# Altium project Logic adapter.PrjPcb
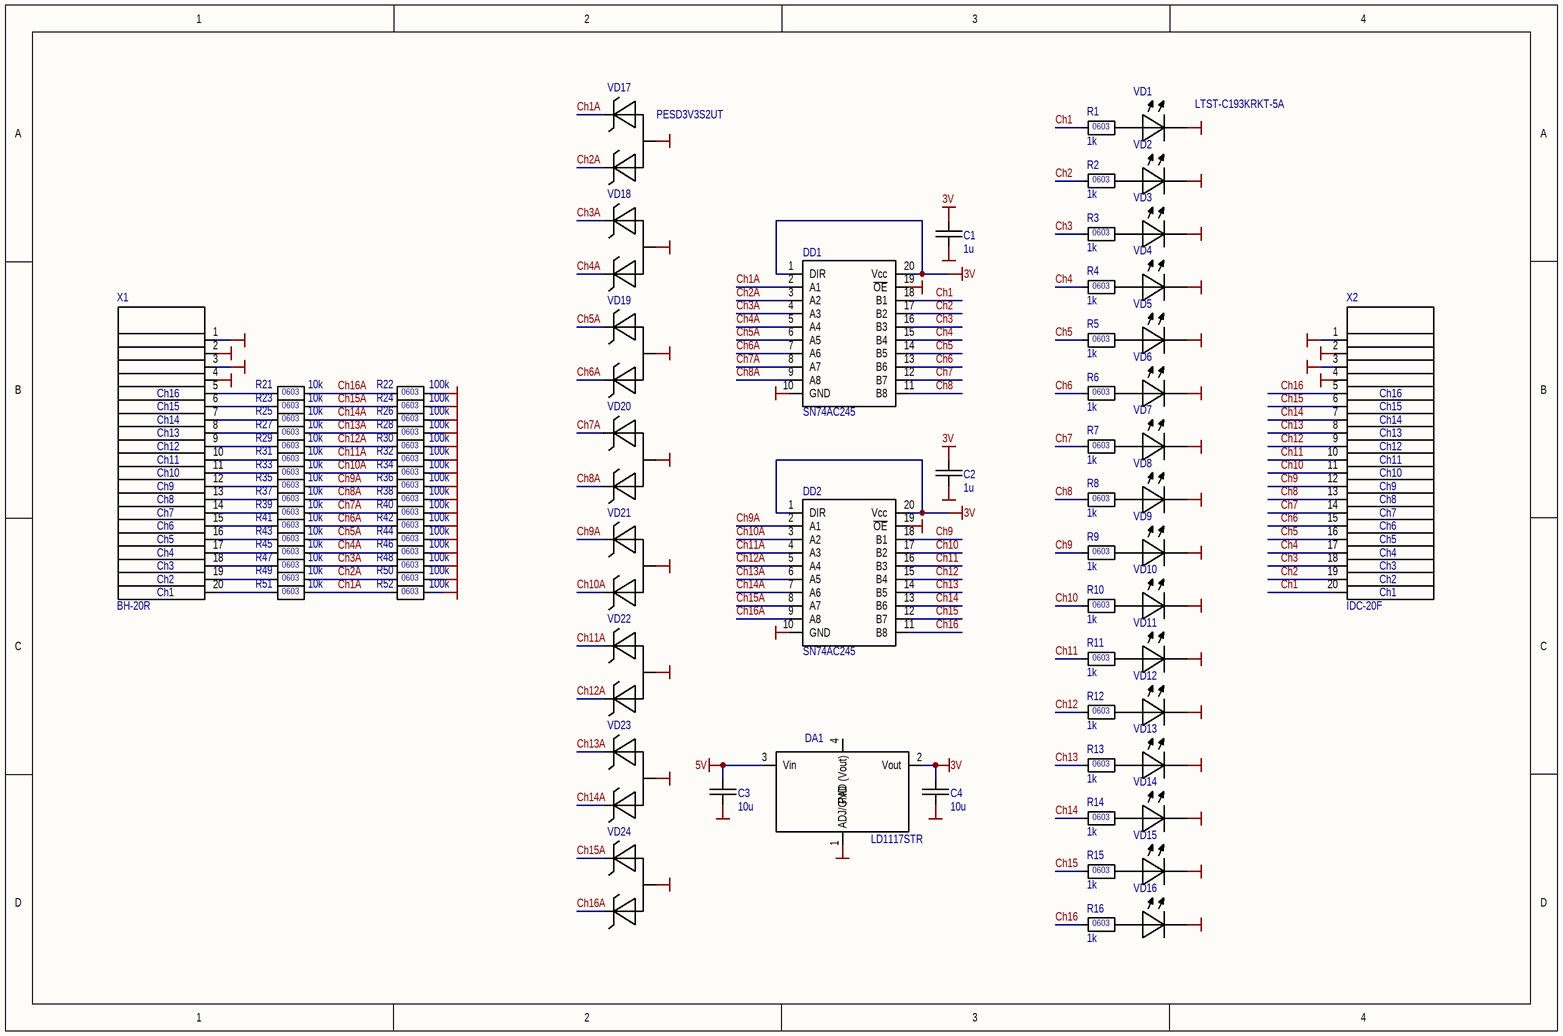
[diagram p0: Logic adapter.SchDoc]
Title: Logic adapter; Revision: Rev4
1 sheet, 81 parts. Net scope: global (net labels, ports and power ports of the same name join across sheets).
Board file: Logic adapter.PcbDoc

## Sheet Logic adapter.SchDoc: Logic adapter
size A4

### Parts
C1  1u  [C0603]
C2  1u  [C0603]
C3  10u  [C0805]
C4  10u  [C0805]
DA1  (no value)  [ON SEMI SOT-223 ST(318H)]
DD1  SN74AC245  [TI-SOIC20 DW]
DD2  SN74AC245  [TI-SOIC20 DW]
R1  1k  [R0603]
R2  1k  [R0603]
R3  1k  [R0603]
R4  1k  [R0603]
R5  1k  [R0603]
R6  1k  [R0603]
R7  1k  [R0603]
R8  1k  [R0603]
R9  1k  [R0603]
R10  1k  [R0603]
R11  1k  [R0603]
R12  1k  [R0603]
R13  1k  [R0603]
R14  1k  [R0603]
R15  1k  [R0603]
R16  1k  [R0603]
R21  10k  [R0603]
R22  100k  [R0603]
R23  10k  [R0603]
R24  100k  [R0603]
R25  10k  [R0603]
R26  100k  [R0603]
R27  10k  [R0603]
R28  100k  [R0603]
R29  10k  [R0603]
R30  100k  [R0603]
R31  10k  [R0603]
R32  100k  [R0603]
R33  10k  [R0603]
R34  100k  [R0603]
R35  10k  [R0603]
R36  100k  [R0603]
R37  10k  [R0603]
R38  100k  [R0603]
R39  10k  [R0603]
R40  100k  [R0603]
R41  10k  [R0603]
R42  100k  [R0603]
R43  10k  [R0603]
R44  100k  [R0603]
R45  10k  [R0603]
R46  100k  [R0603]
R47  10k  [R0603]
R48  100k  [R0603]
R49  10k  [R0603]
R50  100k  [R0603]
R51  10k  [R0603]
R52  100k  [R0603]
VD1  Part Number: LTST-C193KRKT-5A  [LTST-C193 RED]  (hidden comment: Red)
VD2  Red  [LTST-C193 RED]  (value not drawn)
VD3  Red  [LTST-C193 RED]  (value not drawn)
VD4  Red  [LTST-C193 RED]  (value not drawn)
VD5  Red  [LTST-C193 RED]  (value not drawn)
VD6  Red  [LTST-C193 RED]  (value not drawn)
VD7  Red  [LTST-C193 RED]  (value not drawn)
VD8  Red  [LTST-C193 RED]  (value not drawn)
VD9  Red  [LTST-C193 RED]  (value not drawn)
VD10  Red  [LTST-C193 RED]  (value not drawn)
VD11  Red  [LTST-C193 RED]  (value not drawn)
VD12  Red  [LTST-C193 RED]  (value not drawn)
VD13  Red  [LTST-C193 RED]  (value not drawn)
VD14  Red  [LTST-C193 RED]  (value not drawn)
VD15  Red  [LTST-C193 RED]  (value not drawn)
VD16  Red  [LTST-C193 RED]  (value not drawn)
VD17  PESD3V3S2UT  [NXP-SOT23]
VD18  PESD3V3S2UT  [NXP-SOT23]  (value not drawn)
VD19  PESD3V3S2UT  [NXP-SOT23]  (value not drawn)
VD20  PESD3V3S2UT  [NXP-SOT23]  (value not drawn)
VD21  PESD3V3S2UT  [NXP-SOT23]  (value not drawn)
VD22  PESD3V3S2UT  [NXP-SOT23]  (value not drawn)
VD23  PESD3V3S2UT  [NXP-SOT23]  (value not drawn)
VD24  PESD3V3S2UT  [NXP-SOT23]  (value not drawn)
X1  BH-20R  [BH-20R]
X2  IDC-20F  [IDC-20F-EDGE]

### Nets
3V: C1.1 C2.1 C4.1 DA1.2(Vout) DD1.1(DIR) DD1.20(Vcc) DD2.1(DIR) DD2.20(Vcc)
5V: C3.1 DA1.3(Vin)
GND: C1.2 C2.2 C3.2 C4.2 DA1.1(ADJ/GND) DD1.10(GND) DD1.19(~{OE}) DD2.10(GND) DD2.19(~{OE}) R22.2 R24.2 R26.2 R28.2 R30.2 R32.2 R34.2 R36.2 R38.2 R40.2 R42.2 R44.2 R46.2 R48.2 R50.2 R52.2 VD1.1(C) VD2.1(C) VD3.1(C) VD4.1(C) VD5.1(C) VD6.1(C) VD7.1(C) VD8.1(C) VD9.1(C) VD10.1(C) VD11.1(C) VD12.1(C) VD13.1(C) VD14.1(C) VD15.1(C) VD16.1(C) VD17.3(COM) VD18.3(COM) VD19.3(COM) VD20.3(COM) VD21.3(COM) VD22.3(COM) VD23.3(COM) VD24.3(COM) X1.1 X1.2 X1.3 X1.4 X2.1 X2.2 X2.3 X2.4
Ch1: DD1.18(B1) R1.1 X2.20
Ch1A: DD1.2(A1) R51.2 R52.1 VD17.1
Ch2: DD1.17(B2) R2.1 X2.19
Ch2A: DD1.3(A2) R49.2 R50.1 VD17.2
Ch3: DD1.16(B3) R3.1 X2.18
Ch3A: DD1.4(A3) R47.2 R48.1 VD18.1
Ch4: DD1.15(B4) R4.1 X2.17
Ch4A: DD1.5(A4) R45.2 R46.1 VD18.2
Ch5: DD1.14(B5) R5.1 X2.16
Ch5A: DD1.6(A5) R43.2 R44.1 VD19.1
Ch6: DD1.13(B6) R6.1 X2.15
Ch6A: DD1.7(A6) R41.2 R42.1 VD19.2
Ch7: DD1.12(B7) R7.1 X2.14
Ch7A: DD1.8(A7) R39.2 R40.1 VD20.1
Ch8: DD1.11(B8) R8.1 X2.13
Ch8A: DD1.9(A8) R37.2 R38.1 VD20.2
Ch9: DD2.18(B1) R9.1 X2.12
Ch9A: DD2.2(A1) R35.2 R36.1 VD21.1
Ch10: DD2.17(B2) R10.1 X2.11
Ch10A: DD2.3(A2) R33.2 R34.1 VD21.2
Ch11: DD2.16(B3) R11.1 X2.10
Ch11A: DD2.4(A3) R31.2 R32.1 VD22.1
Ch12: DD2.15(B4) R12.1 X2.9
Ch12A: DD2.5(A4) R29.2 R30.1 VD22.2
Ch13: DD2.14(B5) R13.1 X2.8
Ch13A: DD2.6(A5) R27.2 R28.1 VD23.1
Ch14: DD2.13(B6) R14.1 X2.7
Ch14A: DD2.7(A6) R25.2 R26.1 VD23.2
Ch15: DD2.12(B7) R15.1 X2.6
Ch15A: DD2.8(A7) R23.2 R24.1 VD24.1
Ch16: DD2.11(B8) R16.1 X2.5
Ch16A: DD2.9(A8) R21.2 R22.1 VD24.2
NetR1_2: R1.2 VD1.2(A)
NetR2_2: R2.2 VD2.2(A)
NetR3_2: R3.2 VD3.2(A)
NetR4_2: R4.2 VD4.2(A)
NetR5_2: R5.2 VD5.2(A)
NetR6_2: R6.2 VD6.2(A)
NetR7_2: R7.2 VD7.2(A)
NetR8_2: R8.2 VD8.2(A)
NetR9_2: R9.2 VD9.2(A)
NetR10_2: R10.2 VD10.2(A)
NetR11_2: R11.2 VD11.2(A)
NetR12_2: R12.2 VD12.2(A)
NetR13_2: R13.2 VD13.2(A)
NetR14_2: R14.2 VD14.2(A)
NetR15_2: R15.2 VD15.2(A)
NetR16_2: R16.2 VD16.2(A)
NetR21_1: R21.1 X1.5
NetR23_1: R23.1 X1.6
NetR25_1: R25.1 X1.7
NetR27_1: R27.1 X1.8
NetR29_1: R29.1 X1.9
NetR31_1: R31.1 X1.10
NetR33_1: R33.1 X1.11
NetR35_1: R35.1 X1.12
NetR37_1: R37.1 X1.13
NetR39_1: R39.1 X1.14
NetR41_1: R41.1 X1.15
NetR43_1: R43.1 X1.16
NetR45_1: R45.1 X1.17
NetR47_1: R47.1 X1.18
NetR49_1: R49.1 X1.19
NetR51_1: R51.1 X1.20

Not connected (* = marked no-connect by the designer): DA1 4(PAD_(Vout))

### Notes on the sheet
- (near X1) Ch12
- (near X1) Ch13
- (near X1) Ch14
- (near X1) Ch15
- (near X1) Ch16
- (near X2) Ch12
- (near X2) Ch13
- (near X2) Ch14
- (near X2) Ch15
- (near X2) Ch16
- (near X1) Ch7
- (near X1) Ch8
- (near X1) Ch9
- (near X1) Ch10
- (near X1) Ch11
- (near X2) Ch7
- (near X2) Ch8
- (near X2) Ch9
- (near X2) Ch10
- (near X2) Ch11
- (near X1) Ch2
- (near X1) Ch3
- (near X1) Ch4
- (near X1) Ch5
- (near X1) Ch6
- (near X2) Ch2
- (near X2) Ch3
- (near X2) Ch4
- (near X2) Ch5
- (near X2) Ch6
- (near X1) Ch1
- (near X2) Ch1
- Title
- Size:
- Date:
- A4
- Number:
- Time:
- Revision:
- Sheet
- of
- File:
- (in symbol R0603 1k ±1% E24) 0603
- (in symbol R0603 10k ±1% E24) 0603
- (in symbol R0603 100k ±1% E24) 0603

### Library data of the parts
C1 C2 = C0603 1u 10V X6S 105°C ±20%: General  ceramic capacitor; Part Number: GRM185C81A105ME36#; Voltage: 10V; Dielectric: X6S; Tolerance: ±20%; Vendor: Murata; Component Name: C0603 1u 10V X6S 105°C ±20%; HelpURL: https://psearch.en.murata.com/capacitor/result/smd/?pid=GRM185C81A105ME36#; Temperature: 105°C; Pins: 2; Package: C0603; Value: 1u; LCSC Part #: C15849
C3 C4 = C0805 10u 10V X6S 105°C ±10%: General  ceramic capacitor; Part Number: GRM21BC81A106KE18#; Alt Part: C2012X6S1A106K085AC(TDK); Voltage: 10V; Dielectric: X6S; Tolerance: ±10%; Vendor: Murata; Component Name: C0805 10u 10V X6S 105°C ±10%; HelpURL: https://psearch.en.murata.com/capacitor/result/smd/?pid=GRM21BC81A106KE18#; Temperature: 105°C; Pins: 2; Package: C0805; Value: 10u; LCSC Part #: C1046
DA1 = LD1117STR: LDO ADJ 0.8mA; Vendor: ON; Component Name: LD1117STR; Part Number: LD1117STR; HelpURL: https://www.chipdip.ru/product/ld1117str-2; Pins: 4; Package: SOT-223; LCSC Part #: C426566
DD1 DD2 = SN74AC245DW: Octal bus transceiver; Vendor: TI; Component Name: SN74AC245DW; Part Number: SN74AC245DW; HelpURL: https://www.ti.com/product/SN74AC245; Pins: 20; Package: SOIC20; Value: SN74AC245; LCSC Part #: C354145
R1-R16 = R0603 1k ±1% E24: Thick Film Chip Resistor - CR Series; Part Number: CR-03FL7----1k; Alt Part: RTT031001FTH (Ralec); Vendor: Viking; Tolerance: ±1%; Voltage: 75V; Power: 1/10W; Component Name: R0603 1k ±1% E24; HelpURL: https://www.viking.com.tw/en/search/index.html?f%5Bname_model%5D=CR-03FL7----1k&type=product; Pins: 2; Package: R0603; Price: 0.001; Value: 1k; LCSC Part #: C21190
R21 R23 R25 R27 R29 R31 R33 R35 R37 R39 R41 R43 R45 R47 R49 R51 = R0603 10k ±1% E24: Thick Film Chip Resistor - CR Series; Part Number: CR-03FL7---10k; Alt Part: RTT031002FTH (Ralec); Vendor: Viking; Tolerance: ±1%; Voltage: 75V; Power: 1/10W; Component Name: R0603 10k ±1% E24; HelpURL: https://www.viking.com.tw/en/search/index.html?f%5Bname_model%5D=CR-03FL7---10k&type=product; Pins: 2; Package: R0603; Price: 0.001; Value: 10k; LCSC Part #: C25804
R22 R24 R26 R28 R30 R32 R34 R36 R38 R40 R42 R44 R46 R48 R50 R52 = R0603 100k ±1% E24: Thick Film Chip Resistor - CR Series; Part Number: CR-03FL7--100k; Alt Part: RTT031003FTH (Ralec); Vendor: Viking; Tolerance: ±1%; Voltage: 75V; Power: 1/10W; Component Name: R0603 100k ±1% E24; HelpURL: https://www.viking.com.tw/en/search/index.html?f%5Bname_model%5D=CR-03FL7--100k&type=product; Pins: 2; Package: R0603; Price: 0.001; Value: 100k; LCSC Part #: C25803
VD1 = 0603 0h35 5mA RED KRKT: TopView Single Color Chip LED; Vendor: Lite-On; WaveLength: 631 @ 5mA; Brightness: 7.1~45 @ 5mA; Current: 5mA; Component Name: 0603 0h35 5mA RED KRKT; HelpURL: http://optoelectronics.liteon.com/en-global/Led/LED-Component/Detail/448?param4=1; Pins: 2; Package: 0603 0h35; Value: Red; LCSC Part #: C157741
VD2-VD16 = 0603 0h35 5mA RED KRKT: TopView Single Color Chip LED; Part Number: LTST-C193KRKT-5A; Vendor: Lite-On; WaveLength: 631 @ 5mA; Brightness: 7.1~45 @ 5mA; Current: 5mA; Component Name: 0603 0h35 5mA RED KRKT; HelpURL: http://optoelectronics.liteon.com/en-global/Led/LED-Component/Detail/448?param4=1; Pins: 2; Package: 0603 0h35; Value: Red; LCSC Part #: C157741
VD17-VD24 = PESD3V3S2UT: Double ESD protection diodes; Vendor: NXP; Component Name: PESD3V3S2UT; Part Number: PESD3V3S2UT; HelpURL: https://static.chipdip.ru/lib/583/DOC001583051.pdf; Pins: 3; Package: SOT-23; Value: PESD3V3S2UT; LCSC Part #: C84276
X1 = BH-20R: 2.54mm IDC right angle; Component Name: BH-20R; Part Number: BH-20R; Pins: 20; Value: BH-20R; LCSC Part #: C9144
X2 = IDC-20F-EDGE: Component Name: IDC-20F-EDGE; Part Number: IDC-20F; Pins: 20; Value: IDC-20F; LCSC Part #: C20346

## Assembly variants
JLCSMT: not fitted C3 C4 DA1 DD1 DD2 R22 R24 R26 R28 R30 R32 R34 R36 R38 R40 R42 R44 R46 R48 R50 R52 VD17 VD18 VD19 VD20 VD21 VD22 VD23 VD24 X1 X2